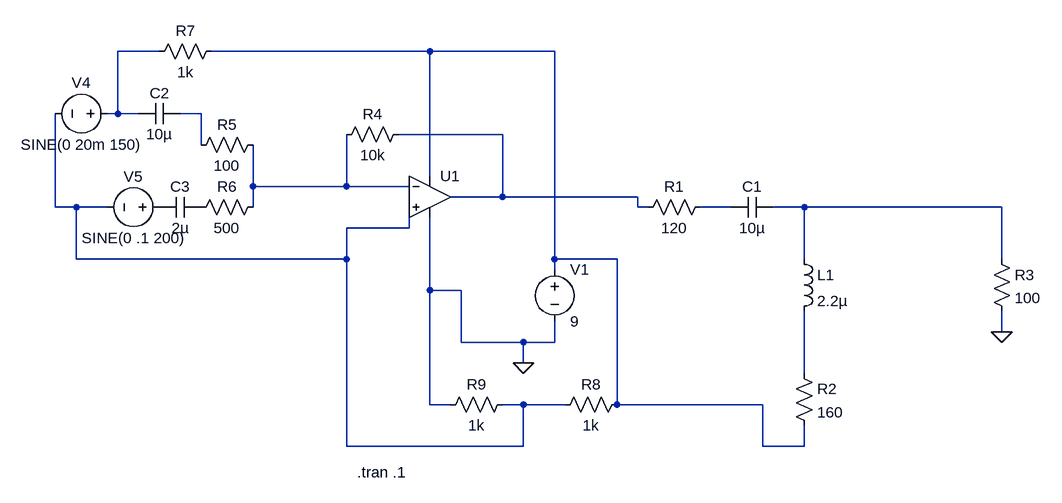
[diagram p0: schematic transmitter.asc]
transmitter.asc, the LTspice schematic file:
Version 4
SHEET 1 1532 680
WIRE -272 -368 -336 -368
WIRE 144 -368 -192 -368
WIRE 336 -368 144 -368
WIRE -336 -272 -336 -368
WIRE -336 -272 -352 -272
WIRE -304 -272 -336 -272
WIRE -208 -272 -240 -272
WIRE 256 -240 96 -240
WIRE -208 -224 -208 -272
WIRE 144 -176 144 -368
WIRE -128 -160 -128 -224
WIRE 16 -160 16 -240
WIRE 16 -160 -128 -160
WIRE 112 -160 16 -160
WIRE 256 -144 256 -240
WIRE 256 -144 176 -144
WIRE 464 -144 256 -144
WIRE -432 -128 -432 -272
WIRE -400 -128 -432 -128
WIRE -352 -128 -400 -128
WIRE -128 -128 -128 -160
WIRE 464 -128 464 -144
WIRE 480 -128 464 -128
WIRE 608 -128 560 -128
WIRE 720 -128 672 -128
WIRE 1024 -128 720 -128
WIRE 112 -96 112 -128
WIRE 112 -96 16 -96
WIRE -400 -48 -400 -128
WIRE 16 -48 16 -96
WIRE 16 -48 -400 -48
WIRE 336 -48 336 -368
WIRE 432 -48 336 -48
WIRE 720 -48 720 -128
WIRE 1024 -48 1024 -128
WIRE 336 -32 336 -48
WIRE 144 0 144 -112
WIRE 192 0 144 0
WIRE 1024 64 1024 32
WIRE 192 80 192 0
WIRE 288 80 192 80
WIRE 336 80 336 48
WIRE 336 80 288 80
WIRE 288 112 288 80
WIRE 720 128 720 32
WIRE 144 176 144 0
WIRE 176 176 144 176
WIRE 288 176 256 176
WIRE 352 176 288 176
WIRE 432 176 432 -48
WIRE 656 176 432 176
WIRE 16 240 16 -48
WIRE 288 240 288 176
WIRE 288 240 16 240
WIRE 656 240 656 176
WIRE 720 240 720 208
WIRE 720 240 656 240
FLAG 1024 64 0
FLAG 288 112 0
SYMBOL res 464 -112 R270
WINDOW 0 32 56 VTop 2
WINDOW 3 0 56 VBottom 2
SYMATTR InstName R1
SYMATTR Value 120
SYMBOL cap 608 -112 R270
WINDOW 0 32 32 VTop 2
WINDOW 3 0 32 VBottom 2
SYMATTR InstName C1
SYMATTR Value 10µ
SYMBOL ind 704 -64 R0
SYMATTR InstName L1
SYMATTR Value 2.2µ
SYMBOL res 1008 -64 R0
SYMATTR InstName R3
SYMATTR Value 100
SYMBOL res 704 112 R0
SYMATTR InstName R2
SYMATTR Value 160
SYMBOL Opamps\\UniversalOpamp2 144 -144 R0
SYMATTR InstName U1
SYMBOL res 112 -256 R90
WINDOW 0 0 56 VBottom 2
WINDOW 3 32 56 VTop 2
SYMATTR InstName R4
SYMATTR Value 10k
SYMBOL res -112 -240 R90
WINDOW 0 0 56 VBottom 2
WINDOW 3 32 56 VTop 2
SYMATTR InstName R5
SYMATTR Value 100
SYMBOL res -112 -144 R90
WINDOW 0 0 56 VBottom 2
WINDOW 3 32 56 VTop 2
SYMATTR InstName R6
SYMATTR Value 500
SYMBOL voltage -256 -128 R90
WINDOW 0 -32 56 VBottom 2
WINDOW 3 32 56 VTop 2
WINDOW 123 0 0 Left 2
WINDOW 39 0 0 Left 2
SYMATTR InstName V5
SYMATTR Value SINE(0 .1 200)
SYMBOL voltage -336 -272 R90
WINDOW 0 -32 56 VBottom 2
WINDOW 3 32 56 VTop 2
WINDOW 123 0 0 Left 2
WINDOW 39 0 0 Left 2
SYMATTR InstName V4
SYMATTR Value SINE(0 20m 150)
SYMBOL cap -240 -288 R90
WINDOW 0 0 32 VBottom 2
WINDOW 3 32 32 VTop 2
SYMATTR InstName C2
SYMATTR Value 10µ
SYMBOL res -288 -352 R270
WINDOW 0 32 56 VTop 2
WINDOW 3 0 56 VBottom 2
SYMATTR InstName R7
SYMATTR Value 1k
SYMBOL cap -208 -144 R90
WINDOW 0 0 32 VBottom 2
WINDOW 3 32 32 VTop 2
SYMATTR InstName C3
SYMATTR Value 2µ
SYMBOL voltage 336 -48 R0
WINDOW 123 0 0 Left 2
WINDOW 39 0 0 Left 2
SYMATTR InstName V1
SYMATTR Value 9
SYMBOL res 448 160 R90
WINDOW 0 0 56 VBottom 2
WINDOW 3 32 56 VTop 2
SYMATTR InstName R8
SYMATTR Value 1k
SYMBOL res 272 160 R90
WINDOW 0 0 56 VBottom 2
WINDOW 3 32 56 VTop 2
SYMATTR InstName R9
SYMATTR Value 1k
TEXT 32 280 Left 2 !.tran .1

The netlist it stands for:
* transmitter.asc
R1 N004 N007 120
C1 N007 N008 10µ
L1 N008 N009 2.2µ
R3 N008 0 100
R2 N009 N002 160
XU1 N006 N005 N002 0 N004 level.2 Avol=1Meg GBW=10Meg Slew=10Meg ilimit=25m rail=0 Vos=0 phimargin=45 en=0 enk=0 in=0 ink=0 Rin=500Meg  ; pins IN+ IN- V+ V- OUT
R4 N004 N005 10k
R5 N005 N003 100
R6 N005 P001 500
V5 P002 N006 SINE(0 .1 200)
V4 N001 N006 SINE(0 20m 150)
C2 N003 N001 10µ
R7 N001 N002 1k
C3 P001 P002 2µ
V1 N002 0 9
R8 N002 N006 1k
R9 N006 0 1k
.tran .1
.lib UniversalOpamps2.sub
.backanno
.end